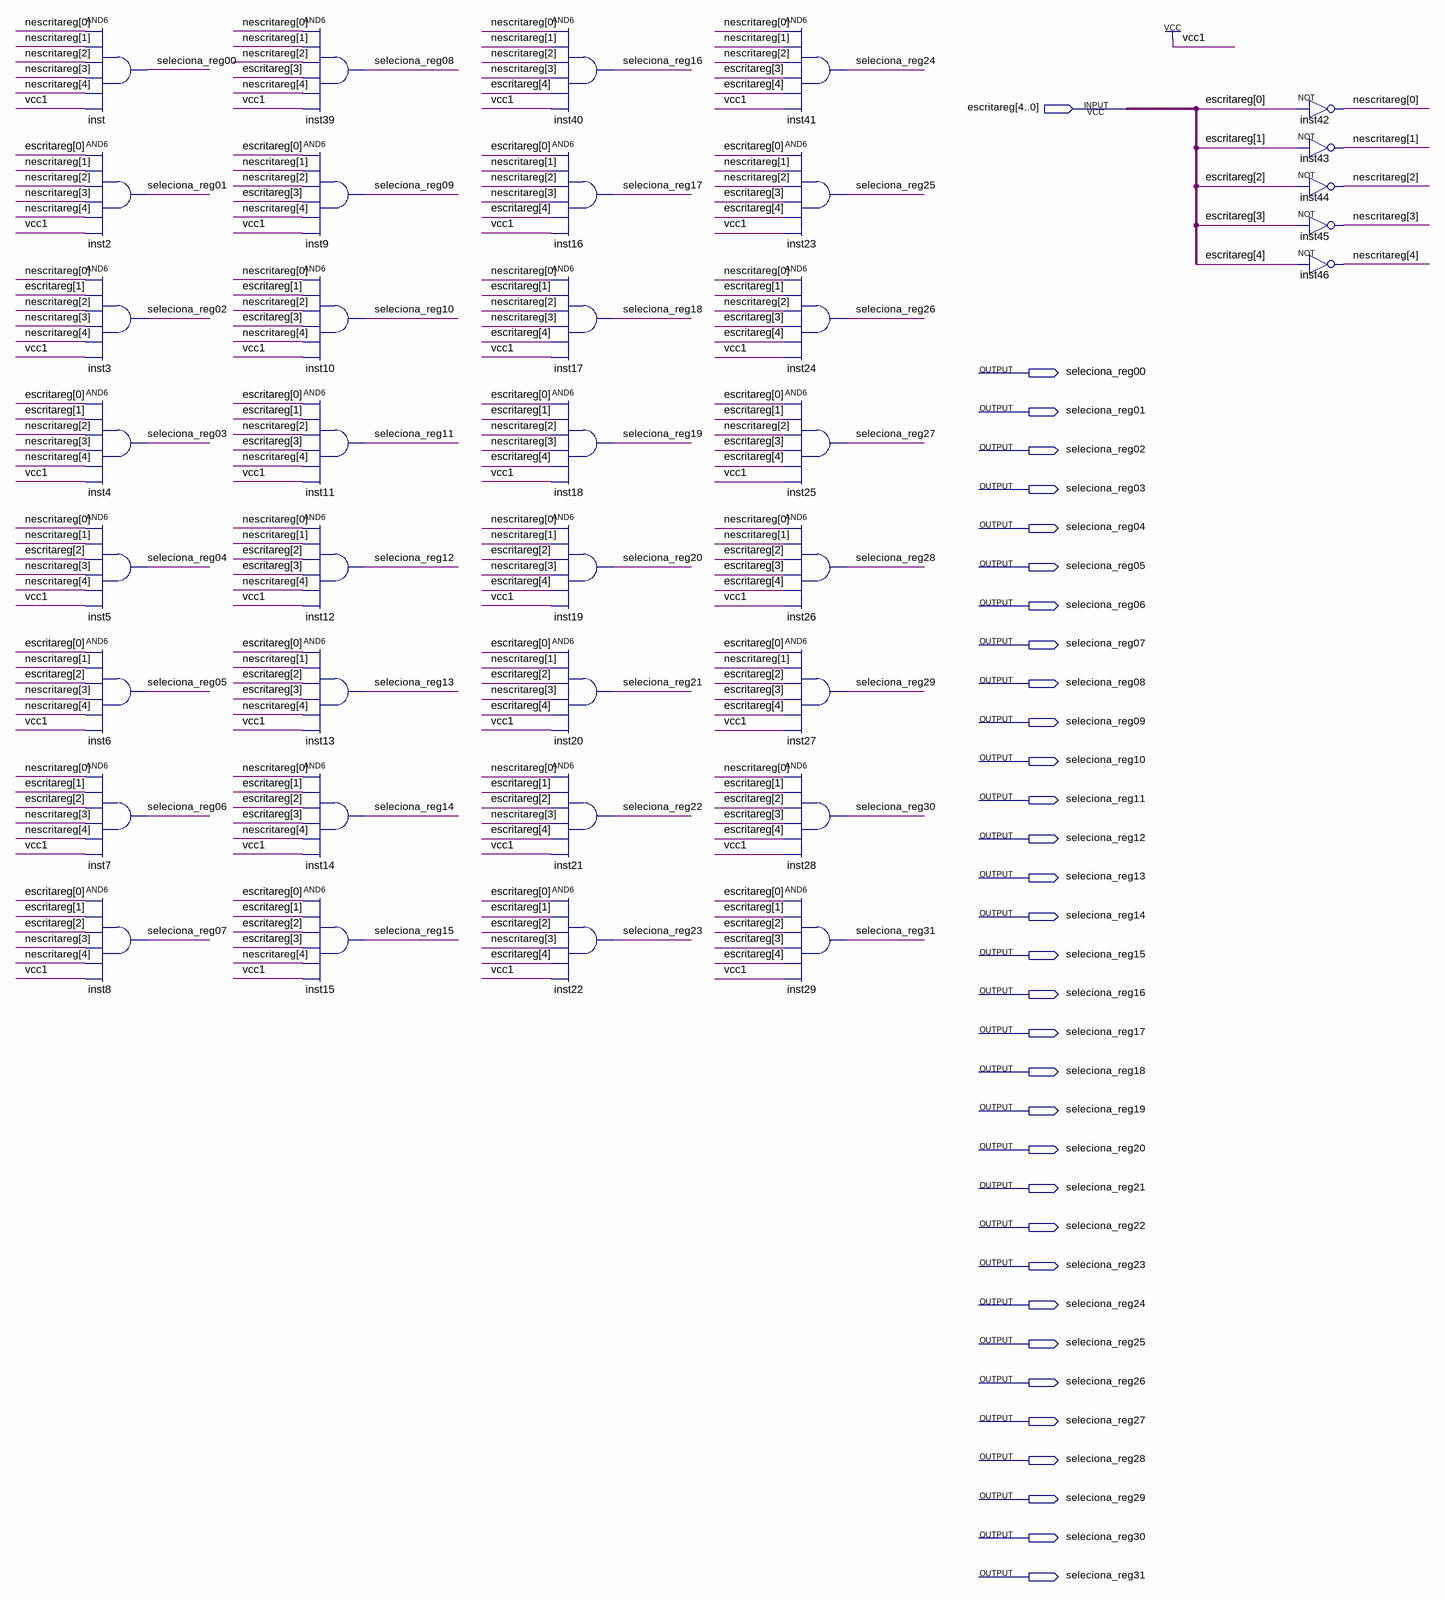
[diagram p0: schematic sheet]
// Quartus schematic decotificador_reg.bdf as structural Verilog: 37 symbols, 33 pins
module decotificador_reg (
  input  [4:0] escritareg,
  output seleciona_reg00,
  output seleciona_reg01,
  output seleciona_reg02,
  output seleciona_reg03,
  output seleciona_reg04,
  output seleciona_reg05,
  output seleciona_reg06,
  output seleciona_reg07,
  output seleciona_reg08,
  output seleciona_reg09,
  output seleciona_reg10,
  output seleciona_reg11,
  output seleciona_reg12,
  output seleciona_reg13,
  output seleciona_reg14,
  output seleciona_reg15,
  output seleciona_reg16,
  output seleciona_reg17,
  output seleciona_reg18,
  output seleciona_reg19,
  output seleciona_reg20,
  output seleciona_reg21,
  output seleciona_reg22,
  output seleciona_reg23,
  output seleciona_reg24,
  output seleciona_reg25,
  output seleciona_reg26,
  output seleciona_reg27,
  output seleciona_reg28,
  output seleciona_reg29,
  output seleciona_reg30,
  output seleciona_reg31
);

  wire [4:0] nescritareg;

  and inst (seleciona_reg00, nescritareg[0], nescritareg[1], nescritareg[2], nescritareg[3], nescritareg[4], 1'b1);
  and inst2 (seleciona_reg01, escritareg[0], nescritareg[1], nescritareg[2], nescritareg[3], nescritareg[4], 1'b1);
  and inst3 (seleciona_reg02, nescritareg[0], escritareg[1], nescritareg[2], nescritareg[3], nescritareg[4], 1'b1);
  and inst4 (seleciona_reg03, escritareg[0], escritareg[1], nescritareg[2], nescritareg[3], nescritareg[4], 1'b1);
  and inst5 (seleciona_reg04, nescritareg[0], nescritareg[1], escritareg[2], nescritareg[3], nescritareg[4], 1'b1);
  and inst6 (seleciona_reg05, escritareg[0], nescritareg[1], escritareg[2], nescritareg[3], nescritareg[4], 1'b1);
  and inst7 (seleciona_reg06, nescritareg[0], escritareg[1], escritareg[2], nescritareg[3], nescritareg[4], 1'b1);
  and inst8 (seleciona_reg07, escritareg[0], escritareg[1], escritareg[2], nescritareg[3], nescritareg[4], 1'b1);
  and inst39 (seleciona_reg08, nescritareg[0], nescritareg[1], nescritareg[2], escritareg[3], nescritareg[4], 1'b1);
  and inst9 (seleciona_reg09, escritareg[0], nescritareg[1], nescritareg[2], escritareg[3], nescritareg[4], 1'b1);
  and inst10 (seleciona_reg10, nescritareg[0], escritareg[1], nescritareg[2], escritareg[3], nescritareg[4], 1'b1);
  and inst11 (seleciona_reg11, escritareg[0], escritareg[1], nescritareg[2], escritareg[3], nescritareg[4], 1'b1);
  and inst12 (seleciona_reg12, nescritareg[0], nescritareg[1], escritareg[2], escritareg[3], nescritareg[4], 1'b1);
  and inst13 (seleciona_reg13, escritareg[0], nescritareg[1], escritareg[2], escritareg[3], nescritareg[4], 1'b1);
  and inst14 (seleciona_reg14, nescritareg[0], escritareg[1], escritareg[2], escritareg[3], nescritareg[4], 1'b1);
  and inst15 (seleciona_reg15, escritareg[0], escritareg[1], escritareg[2], escritareg[3], nescritareg[4], 1'b1);
  and inst40 (seleciona_reg16, nescritareg[0], nescritareg[1], nescritareg[2], nescritareg[3], escritareg[4], 1'b1);
  and inst16 (seleciona_reg17, escritareg[0], nescritareg[1], nescritareg[2], nescritareg[3], escritareg[4], 1'b1);
  and inst17 (seleciona_reg18, nescritareg[0], escritareg[1], nescritareg[2], nescritareg[3], escritareg[4], 1'b1);
  and inst18 (seleciona_reg19, escritareg[0], escritareg[1], nescritareg[2], nescritareg[3], escritareg[4], 1'b1);
  and inst19 (seleciona_reg20, nescritareg[0], nescritareg[1], escritareg[2], nescritareg[3], escritareg[4], 1'b1);
  and inst20 (seleciona_reg21, escritareg[0], nescritareg[1], escritareg[2], nescritareg[3], escritareg[4], 1'b1);
  and inst21 (seleciona_reg22, nescritareg[0], escritareg[1], escritareg[2], nescritareg[3], escritareg[4], 1'b1);
  and inst22 (seleciona_reg23, escritareg[0], escritareg[1], escritareg[2], nescritareg[3], escritareg[4], 1'b1);
  and inst41 (seleciona_reg24, nescritareg[0], nescritareg[1], nescritareg[2], escritareg[3], escritareg[4], 1'b1);
  and inst23 (seleciona_reg25, escritareg[0], nescritareg[1], nescritareg[2], escritareg[3], escritareg[4], 1'b1);
  and inst24 (seleciona_reg26, nescritareg[0], escritareg[1], nescritareg[2], escritareg[3], escritareg[4], 1'b1);
  and inst25 (seleciona_reg27, escritareg[0], escritareg[1], nescritareg[2], escritareg[3], escritareg[4], 1'b1);
  and inst26 (seleciona_reg28, nescritareg[0], nescritareg[1], escritareg[2], escritareg[3], escritareg[4], 1'b1);
  and inst27 (seleciona_reg29, escritareg[0], nescritareg[1], escritareg[2], escritareg[3], escritareg[4], 1'b1);
  and inst28 (seleciona_reg30, nescritareg[0], escritareg[1], escritareg[2], escritareg[3], escritareg[4], 1'b1);
  and inst29 (seleciona_reg31, escritareg[0], escritareg[1], escritareg[2], escritareg[3], escritareg[4], 1'b1);
  not inst42 (nescritareg[0], escritareg[0]);
  not inst43 (nescritareg[1], escritareg[1]);
  not inst44 (nescritareg[2], escritareg[2]);
  not inst45 (nescritareg[3], escritareg[3]);
  not inst46 (nescritareg[4], escritareg[4]);
endmodule
